# EAGLE design buttonboard-v2 (EAGLE 8.7.1)
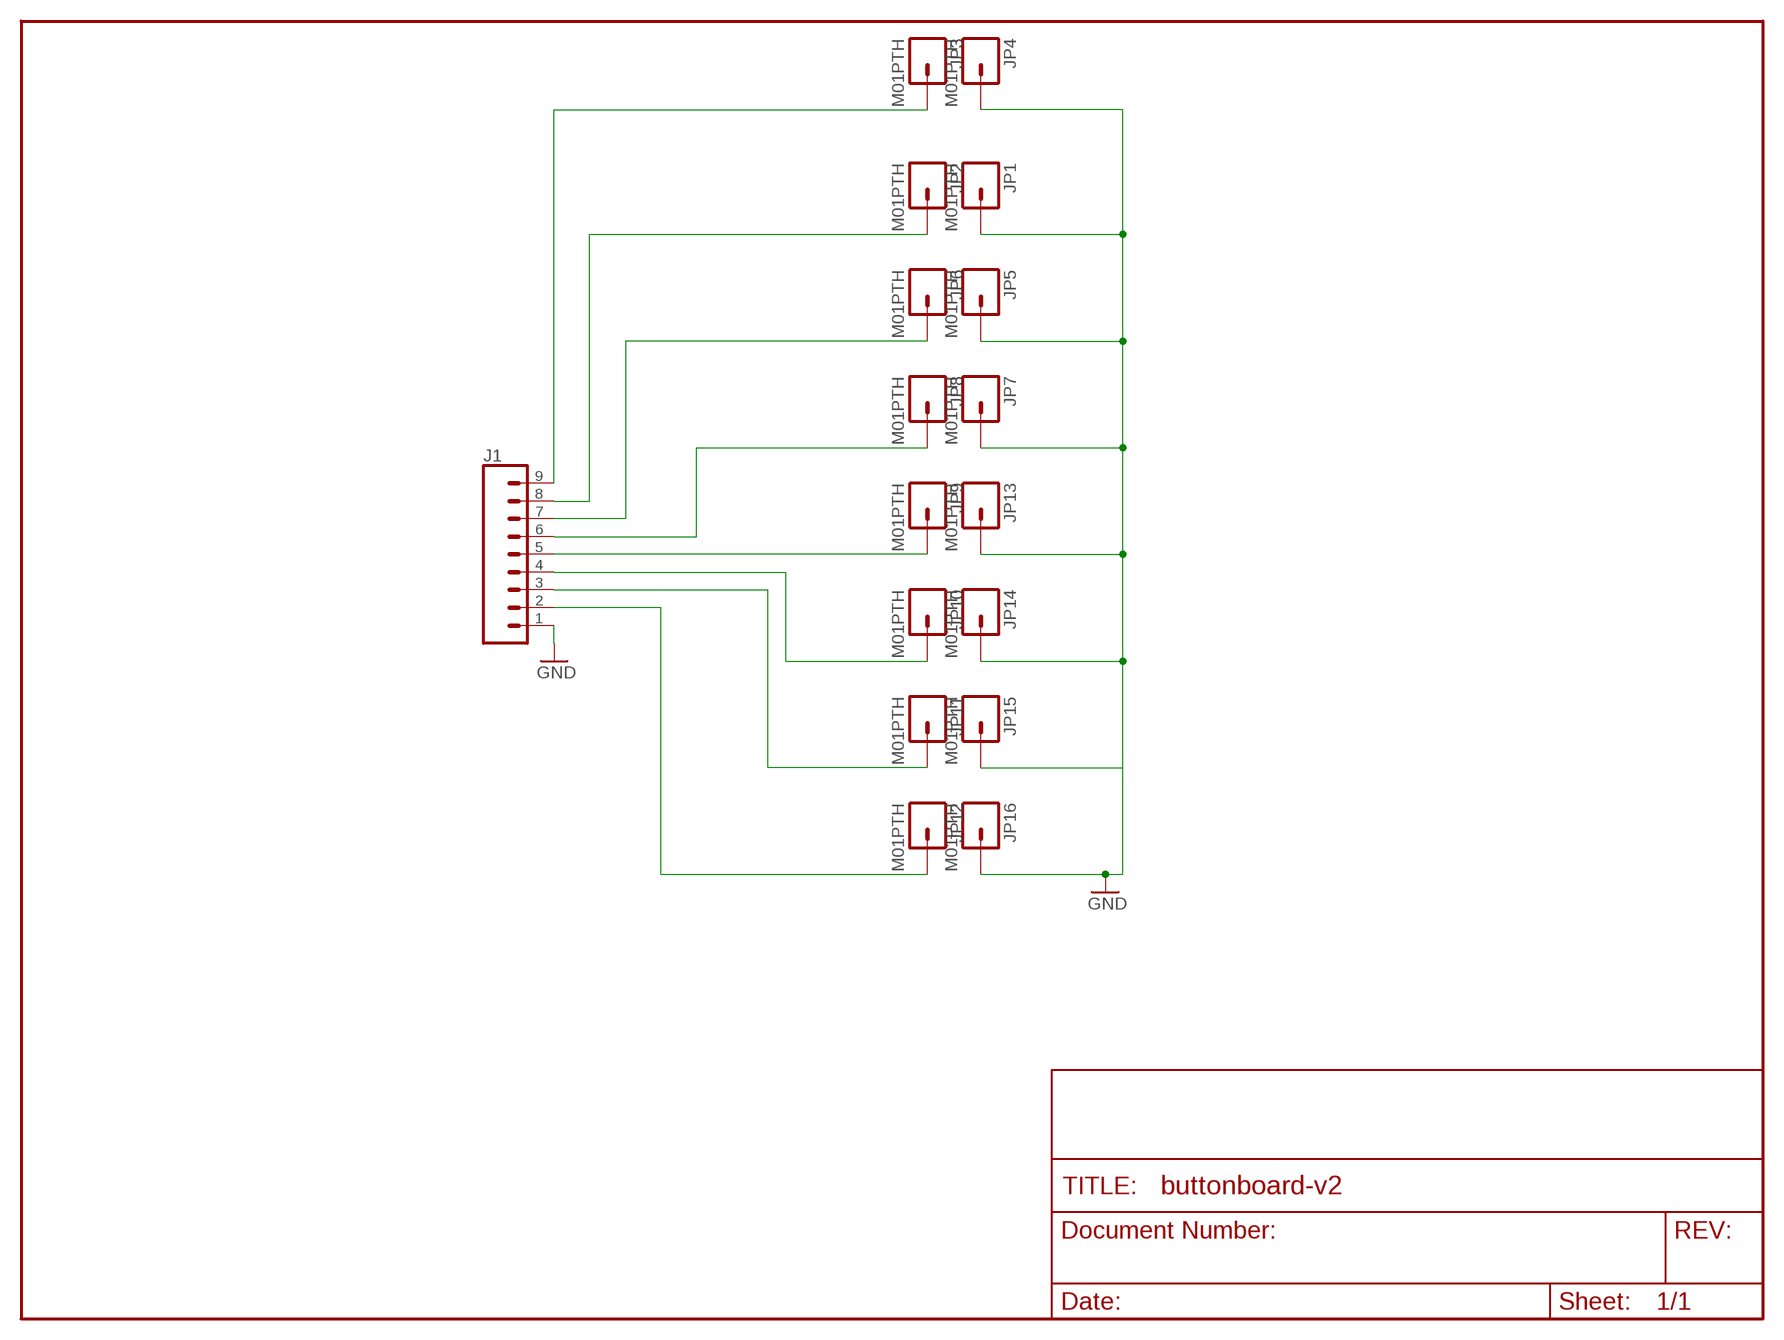
[diagram p0: schematic, sheet 1]

## Parts
J1  CONN_09  [1X09]
JP1  M01PTH  [1X01]
JP2  M01PTH  [1X01]
JP3  M01PTH  [1X01]
JP4  M01PTH  [1X01]
JP5  M01PTH  [1X01]
JP6  M01PTH  [1X01]
JP7  M01PTH  [1X01]
JP8  M01PTH  [1X01]
JP9  M01PTH  [1X01]
JP10  M01PTH  [1X01]
JP11  M01PTH  [1X01]
JP12  M01PTH  [1X01]
JP13  M01PTH  [1X01]
JP14  M01PTH  [1X01]
JP15  M01PTH  [1X01]
JP16  M01PTH  [1X01]

## Nets
BUTTON: JP4.1
GND: J1.1 JP1.1 JP5.1 JP7.1 JP13.1 JP14.1 JP15.1 JP16.1
N$1: J1.9 JP3.1
N$4: J1.8 JP2.1
N$5: J1.7 JP6.1
N$6: J1.6 JP8.1
N$7: J1.5 JP9.1
N$8: J1.4 JP10.1
N$9: J1.3 JP11.1
N$10: J1.2 JP12.1

## Library data of the parts
J1 = SparkFun-Connectors:CONN_09: Multi connection point. Often used as Generic Header-pin footprint for 0.1 inch spaced/style header connections On any of the 0.1 inch spaced packages, you can populate with these: Break Away Headers - Straight <https://www.sparkfun.com/products/116> (PRT-00116) Break Away Male Headers - Right Angle <https://www.sparkfun.com/products/553> (PRT-00553) Female Headers <https://www.sparkfun.com/products/115> (PRT-00115) Break Away Headers - Machine Pin <https://www.sparkfun.com/products/117> (PRT-00117) Break Away Female Headers - Swiss Machine Pin <https://www.sparkfun.com/products/743> (PRT-00743) For SCREWTERMINALS and SPRING TERMINALS visit here: Screw Terimnals on SparkFun.com <https://www.sparkfun.com/search/results?term=Screw+Terminals> (5mm/3.5mm/2.54mm spacing) This device is also useful as a general connection point to wire up your design to another part of your project. Our various solder wires solder well into these plated through hole pads. Hook-Up Wire - Assortment (Stranded, 22 AWG) <https://www.sparkfun.com/products/11375> (PRT-11375) Hook-Up Wire - Assortment (Solid Core, 22 AWG) <https://www.sparkfun.com/products/11367> (PRT-11367) View the entire wire category on our website here <https://www.sparkfun.com/categories/141> Special notes: Molex polarized connector foot print use with SKU : PRT-08231 with associated crimp pins and housings. 1MM SMD Version SKU: PRT-10208 NOTES ON THE VARIANTS LOCK and LOCK_LONGPADS... This footprint was designed to help hold the alignment of a through-hole component (i.e. 6-pin header) while soldering it into place. You may notice that each hole has been shifted either up or down by 0.005 of an inch from it's more standard position (which is a perfectly straight line). This slight alteration caused the pins (the squares in the middle) to touch the edges of the holes. Because they are alternating, it causes a "brace" to hold the component in place. 0.005 has proven to be the perfect amount of "off-center" position when using our standard breakaway headers. Although looks a little odd when you look at the bare footprint, once you have a header in there, the alteration is very hard to notice. Also,if you push a header all the way into place, it is covered up entirely on the bottom side.
JP1-JP16 = SparkFun-Connectors:M01: Header 1 Standard 1-pin 0.1" header. Use with straight break away headers (SKU : PRT-00116), right angle break away headers (PRT-00553), swiss pins (PRT-00743), machine pins (PRT-00117), and female headers (PRT-00115).

## Net classes
0 default: width 0.203 mm
1 vcc: width 0.254 mm

## Board
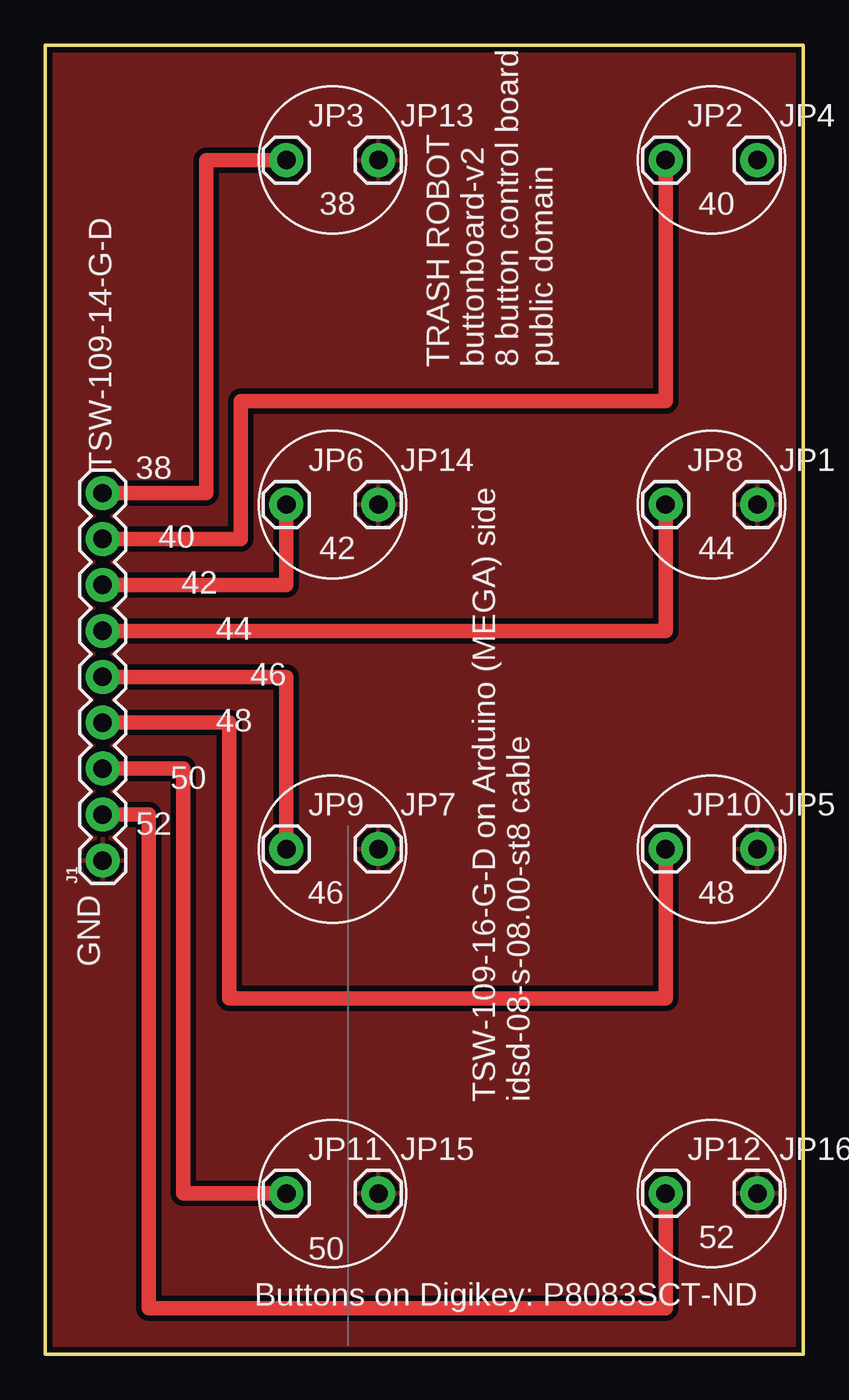
[diagram p1: board, top side]
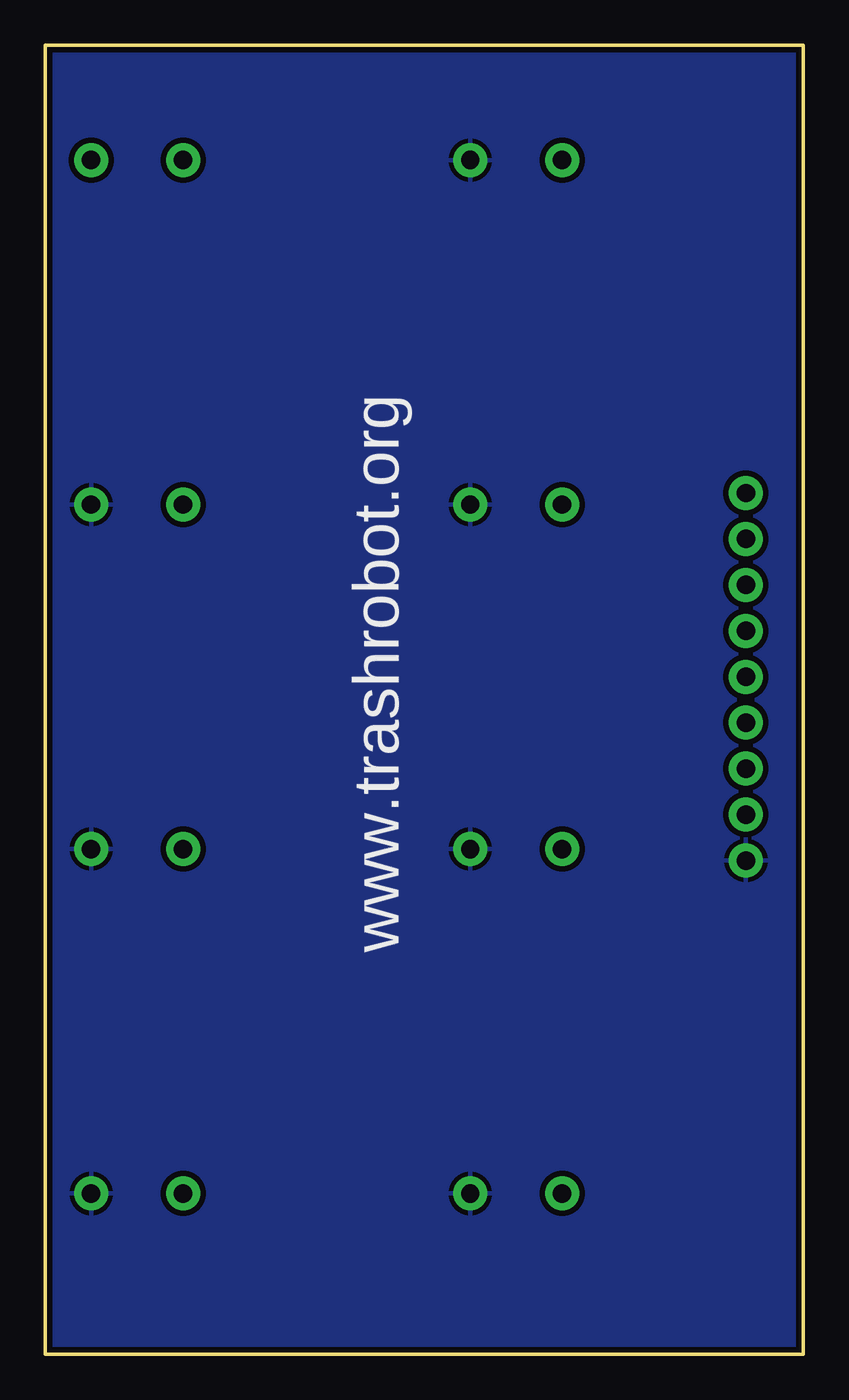
[diagram p2: board, bottom side, seen from below]

Size 41.91 x 72.39 mm. Coordinates in mm from the lower left corner, seen from the top.
Outline: 0,72.39 0,0 41.91,0 41.91,72.39 0,72.39
Copper layers (1*16): Top 0.035mm / dielectric 1.5mm / Bottom 0.035mm
Design rules "default": minimum track width 8mil, minimum drill 20mil, track to track 8mil, track to pad 8mil, pad to pad 8mil, via to via 8mil, smd to smd 8mil, copper to edge 10mil, drill to drill 8mil, minimum pad ring 12mil, minimum via ring 10mil, stop-mask expansion 4mil, vias tented up to drill 25mil, thermal gap 10mil

### Footprints (pad centres in the part's own frame; a part is rotated, then mirrored left to right if it is on the bottom)
1X09 = drill 1.016 pad 1.88: 1 0,0; 2 2.54,0; 3 5.08,0; 4 7.62,0; 5 10.16,0; 6 12.7,0; 7 15.24,0; 8 17.78,0; 9 20.32,0
1X01 = drill 1.016 pad 1.88: 1 0,0

### Placement (x,y rotation side)
J1  3.17,27.3 90 top
JP1  39.37,46.99 0 top
JP2  34.29,66.04 0 top
JP3  13.33,66.04 0 top
JP4  39.37,66.04 0 top
JP5  39.37,27.94 0 top
JP6  13.33,46.99 0 top
JP7  18.41,27.94 0 top
JP8  34.29,46.99 0 top
JP9  13.33,27.94 0 top
JP10  34.29,27.94 0 top
JP11  13.33,8.89 0 top
JP12  34.29,8.89 0 top
JP13  18.41,66.04 0 top
JP14  18.41,46.99 0 top
JP15  18.41,8.89 0 top
JP16  39.37,8.89 0 top

### Tracks (layer width: path | path; a pad name or v marks a point on that pad's centre or on a via)
GND
  pour Top (isolate 0.305): 0,72.39 41.91,72.39 41.91,0 0,0
  pour Bottom (isolate 0.305): 0,72.39 41.91,72.39 41.91,0 0,0
N$1
  Top 0.813: J1.9 8.89,47.62 8.89,66.04 JP3.1
N$4
  Top 0.813: J1.8 10.79,45.09 10.79,52.7 34.29,52.7 JP2.1
N$5
  Top 0.813: J1.7 13.33,42.55 JP6.1
N$6
  Top 0.813: J1.6 34.29,40.01 JP8.1
N$7
  Top 0.813: J1.5 13.33,37.47 JP9.1
N$8
  Top 0.813: J1.4 10.16,34.92 10.16,19.68 34.29,19.68 JP10.1
N$9
  Top 0.813: J1.3 7.62,32.38 7.62,8.89 JP11.1
N$10
  Top 0.813: J1.2 5.71,29.84 5.71,2.54 34.29,2.54 JP12.1

### Text on the board
tPlace: 38 | 40 | TSW-109-14-G-D | TRASH ROBOT / buttonboard-v2 / 8 button control board / public domain | 38 | 40 | 42 | 44 | 42 | 44 | 46 | 48 | 50 | 52 | 46 | 48 | GND | TSW-109-16-G-D on Arduino (MEGA) side / idsd-08-s-08.00-st8 cable | 52 | 50 | Buttons on Digikey: P8083SCT-ND
bPlace: www.trashrobot.org
tValues: Tent Vias! | Arduino Wee v1.3